# Altium schematic sheet MODEM_PT1.SchDoc
size 420 x 297 mm; SheetNumber: 3; SheetTotal: 8
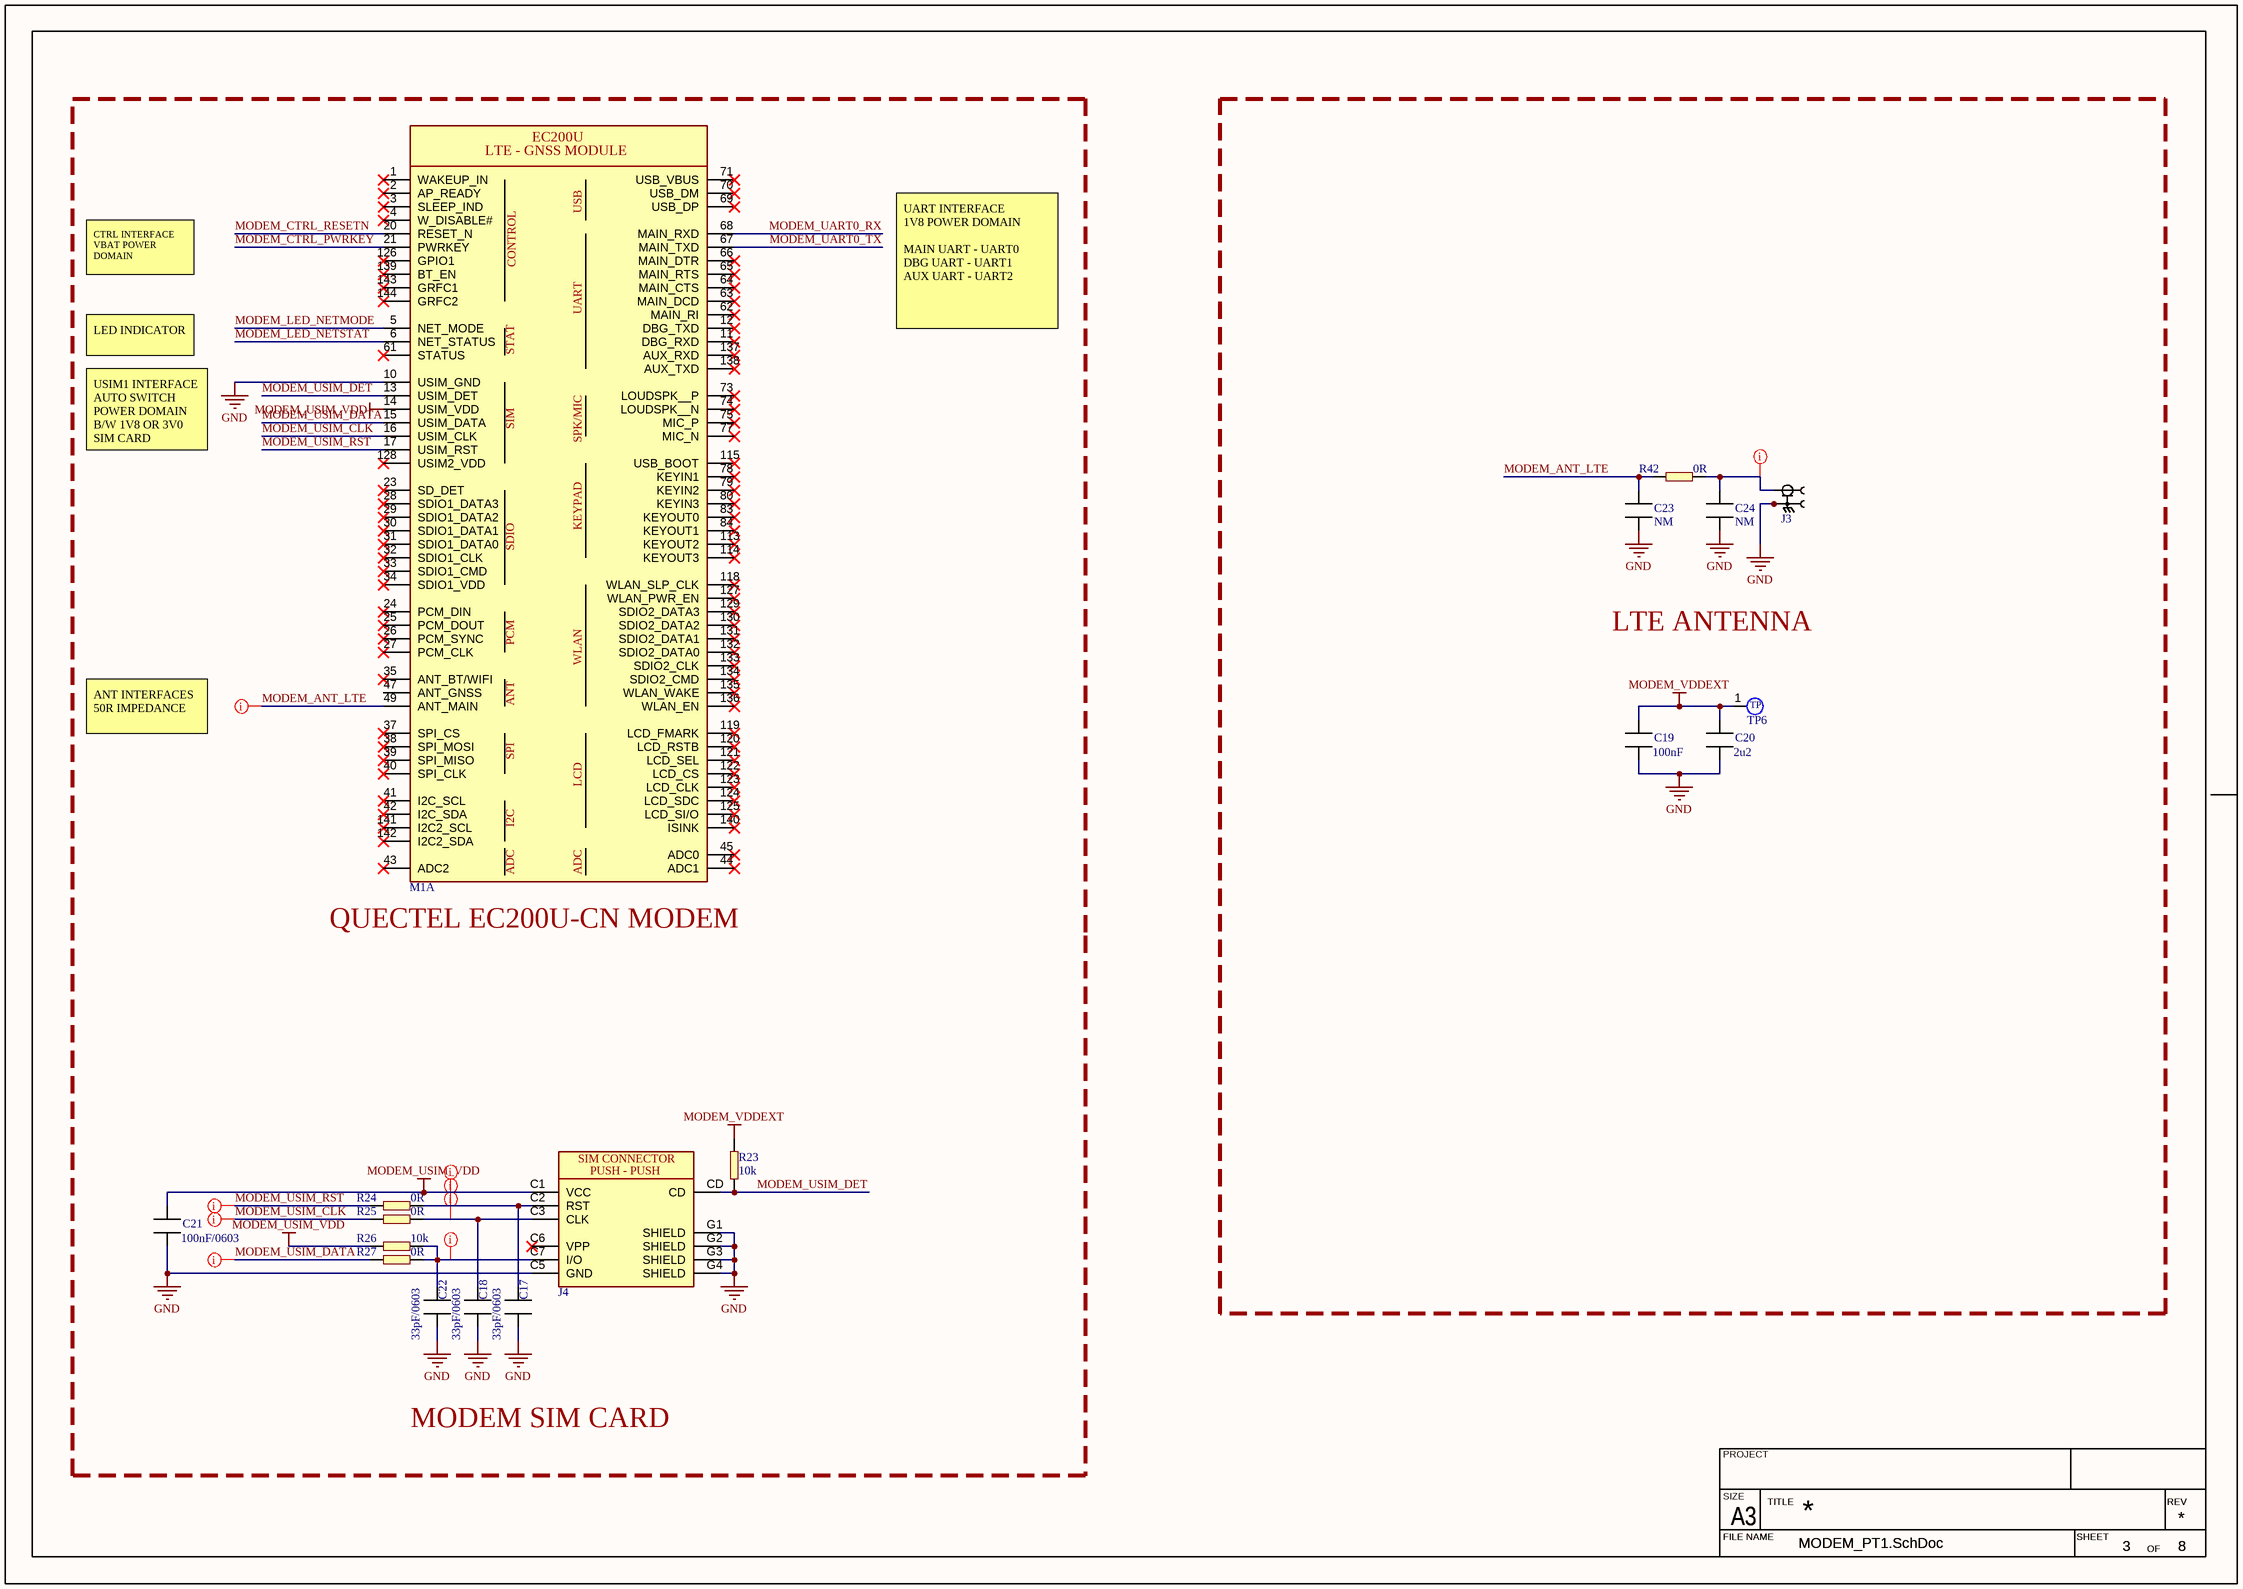
[diagram p0: MODEM_PT1.SchDoc]

## Parts
C17  value 33pF/0603  [CAPC1608X10N]  (hidden comment: ERP_102-1)
C18  value 33pF/0603  [CAPC1608X10N]  (hidden comment: ERP_102-1)
C19  value 100nF  [CAPC2012X13L]  (hidden comment: MLCC_0805)
C20  value 2u2  [CAPC2012X13L]  (hidden comment: MLCC_0805)
C21  value 100nF/0603  [CAPC1608X10N]  (hidden comment: ERP_102-1)
C22  value 33pF/0603  [CAPC1608X10N]  (hidden comment: ERP_102-1)
C23  value NM  [CAPC0603X03L]  (hidden comment: ERP_102-1)  (no BOM)
C24  value NM  [CAPC0603X03L]  (hidden comment: ERP_102-1)  (no BOM)
J3  ERP_148-1  [uFL_50R]  (value not drawn)
J4  MUP-7801-1  [MUP-7801-1]  (value not drawn)
M1  EC200U  [EC200U]  (value not drawn)  (part A of 2)
R23  value 10k  [RES_0603]  (hidden comment: ERP_101-1)
R24  value 0R  [RES_0603]  (hidden comment: ERP_101-1)
R25  value 0R  [RES_0603]  (hidden comment: ERP_101-1)
R26  value 10k  [RES_0603]  (hidden comment: ERP_101-1)
R27  value 0R  [RES_0603]  (hidden comment: ERP_101-1)
R42  value 0R  [RESC0603X03L]  (hidden comment: ERP_101-1)
TP6  TP_1MM  [TP_1MM]  (value not drawn)  (no BOM)

## Blocks framed on the sheet
LTE ANTENNA: C19 C20 C23 C24 J3 R42 TP6

## Nets
GND: C17.2 C18.2 C19.2 C20.2 C21.2 C22.2 C23.1 C24.1 J3.1 J3.2 J4.C5(GND) J4.G1(SHIELD) J4.G2(SHIELD) J4.G3(SHIELD) J4.G4(SHIELD) M1.10(USIM_GND)
MODEM_USIM_VDD: C21.1 J4.C1(VCC) M1.14(USIM_VDD) R26.2
MODEM_VDDEXT: C19.1 C20.1 R23.2 TP6.1
MODEM_ANT_LTE: C23.2 M1.49(ANT_MAIN) R42.2
MODEM_CTRL_PWRKEY: M1.21(PWRKEY)
MODEM_CTRL_RESETN: M1.20(RESET_N)
MODEM_LED_NETMODE: M1.5(NET_MODE)
MODEM_LED_NETSTAT: M1.6(NET_STATUS)
MODEM_UART0_RX: M1.68(MAIN_RXD)
MODEM_UART0_TX: M1.67(MAIN_TXD)
MODEM_USIM_CLK: M1.16(USIM_CLK) R25.2
MODEM_USIM_DATA: M1.15(USIM_DATA) R27.2
MODEM_USIM_DET: J4.CD M1.13(USIM_DET) R23.1
MODEM_USIM_RST: M1.17(USIM_RST) R24.2
NetC17_1: C17.1 J4.C2(RST) R24.1
NetC18_1: C18.1 J4.C3(CLK) R25.1
NetC22_1: C22.1 J4.C7(I/O) R26.1 R27.1
NetC24_2: C24.2 J3.3 R42.1

Not connected (* = marked no-connect by the designer): J4 C6(VPP)*; M1 1(WAKEUP_IN)* 2(AP_READY)* 3(SLEEP_IND)* 4(W_DISABLE#)* 11(DBG_RXD)* 12(DBG_TXD)* 23(SD_DET)* 24(PCM_DIN)* 25(PCM_DOUT)* 26(PCM_SYNC)* 27(PCM_CLK)* 28(SDIO1_DATA3)* 29(SDIO1_DATA2)* 30(SDIO1_DATA1)* 31(SDIO1_DATA0)* 32(SDIO1_CLK)* 33(SDIO1_CMD)* 34(SDIO1_VDD)* 35(ANT_BT/WIFI)* 37(SPI_CS)* 38(SPI_MOSI)* 39(SPI_MISO)* 40(SPI_CLK)* 41(I2C_SCL)* 42(I2C_SDA)* 43(ADC2)* 44(ADC1)* 45(ADC0)* 47(ANT_GNSS) 61(STATUS)* 62(MAIN_RI)* 63(MAIN_DCD)* 64(MAIN_CTS)* 65(MAIN_RTS)* 66(MAIN_DTR)* 69(USB_DP)* 70(USB_DM)* 71(USB_VBUS)* 73(LOUDSPK__P)* 74(LOUDSPK__N)* 75(MIC_P)* 77(MIC_N)* 78(KEYIN1)* 79(KEYIN2)* 80(KEYIN3)* 83(KEYOUT0)* 84(KEYOUT1)* 113(KEYOUT2)* 114(KEYOUT3)* 115(USB_BOOT)* 118(WLAN_SLP_CLK)* 119(LCD_FMARK)* 120(LCD_RSTB)* 121(LCD_SEL)* 122(LCD_CS)* 123(LCD_CLK)* 124(LCD_SDC)* 125(LCD_SI/O)* 126(GPIO1)* 127(WLAN_PWR_EN)* 128(USIM2_VDD)* 129(SDIO2_DATA3)* 130(SDIO2_DATA2)* 131(SDIO2_DATA1)* 132(SDIO2_DATA0)* 133(SDIO2_CLK)* 134(SDIO2_CMD)* 135(WLAN_WAKE)* 136(WLAN_EN)* 137(AUX_RXD)* 138(AUX_TXD)* 139(BT_EN)* 140(ISINK)* 141(I2C2_SCL)* 142(I2C2_SDA)* 143(GRFC1)* 144(GRFC2)*

## Layout directives
net class ANT_50R; rule Width Constraint [Pref Impedance = 50.00ohms    Min Impedance = 50.00ohms    Max Impedance = 50.00ohms]: MODEM_ANT_LTE, NetC24_2
rule Width Constraint [Pref Impedance = 50.00ohms    Min Impedance = 50.00ohms    Max Impedance = 50.00ohms]: MODEM_USIM_CLK, MODEM_USIM_DATA, MODEM_USIM_RST, MODEM_USIM_VDD, NetC17_1, NetC18_1, NetC22_1

## Notes on the sheet
- CTRL INTERFACE
  VBAT POWER DOMAIN
- UART INTERFACE
  1V8 POWER DOMAIN
  MAIN UART - UART0
  DBG UART - UART1
  AUX UART - UART2
- LED INDICATOR
- USIM1 INTERFACE
  AUTO SWITCH POWER DOMAIN B/W 1V8 OR 3V0 SIM CARD
- ANT INTERFACES
  50R IMPEDANCE
- (near M1) QUECTEL EC200U-CN MODEM
- MODEM SIM CARD
- PROJECT
- SIZE
- FILE NAME
- A3
- TITLE
- SHEET
- OF
- REV
- (in symbol EC200U, part A) LTE - GNSS MODULE; USB; CONTROL; UART; STAT; SIM; SPK/MIC; KEYPAD; SDIO; PCM; WLAN; ANT; SPI; LCD; I2C; ADC
- (in symbol MUP-7801-1) SIM CONNECTOR; PUSH - PUSH
- (in symbol TP_1MM) TP

## Library data of the parts
C17 C18 C21 C22 = MLCC_0603: Chip Capacitor, 2-Leads, Body 1.60x0.80mm, IPC Medium Density; Package: 0603; Manufacturer 1: *; Manufacturer Part Number 1: *
C19 C20 = MLCC_0805: Chip Capacitor, 2-Leads, Body 2.00x1.25mm, IPC High Density; Package: 0805; Manufacturer 1: *; Manufacturer Part Number 1: *
C23 C24 = MLCC_0201: Chip Capacitor, 2-Leads, Body 0.60x0.30mm, IPC High Density; Package: 0201; Manufacturer 1: *; Manufacturer Part Number 1: *
J3 = uFL_50R: Package: L3W3; Value: *; ERP: *; Manufacturer 1: *; Manufacturer Part Number 1: *; Supplier 1: *; Suuplier Part Number 1: *
J4 = MUP-7801-1: 7 (6 + 1) Position Card Connector NANO SIM Surface Mount, Right Angle Gold; Manufacturer Part Number 1: MUP-C7801-02; Manufacturer 1: MUP; Package: 7 (6 + 1); Value: *; Supplier Part Number 1: ST2103SD1921
M1 = EC200U: LTE CAT1 MODEM 144 SMD; Manufacturer 1: Quectel; Manufacturer Part Number 1: 027-EC200UCNAA-N05-SGNSA; Value: *
R23-R27 = RES_0603: Package: 0603; Manufacturer 1: *; Manufacturer Part Number 1: *
R42 = RES_0201: Package: 0201; Manufacturer 1: *; Manufacturer Part Number 1: *